# Altium schematic sheet Diode Model.SchDoc
size A4
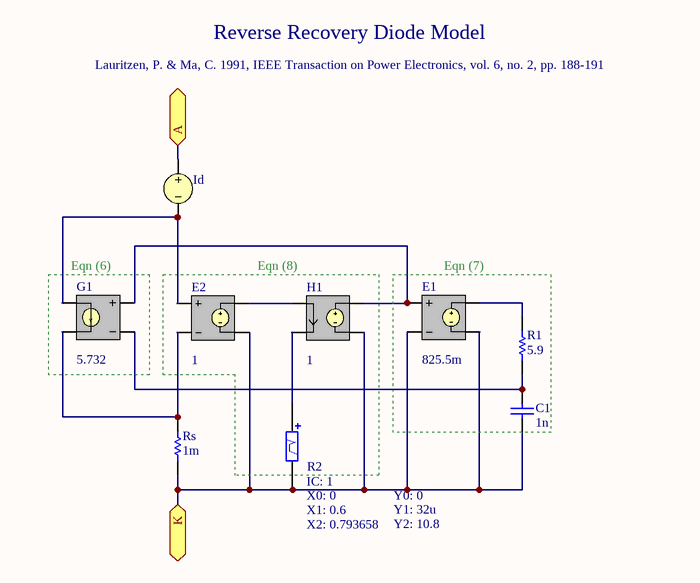
[diagram p0: Diode Model.SchDoc]

## Parts
C1  value 1n  [RAD-0.3]  (hidden comment: Cap)
E1  825.5m
E2  1
G1  5.732
H1  1
Id  VSRC  (value not drawn)
R1  value 5.9  [AXIAL-0.3]  (hidden comment: Res1)
R2  IC: 1  X0: 0  X1: 0.6  Y1: 32u  X2: 0.793658  Y2: 10.8  (hidden comment: SIMPLIS VPWLR2)
Rs  value 1m  [AXIAL-0.3]  (hidden comment: Res1)

## Blocks framed on the sheet
Eqn (6): G1
Eqn (8): E2 H1 R2
Eqn (7): C1 E1 R1

## Ports
A, K

## Nets
A: Id.1 ; port A
K: C1.1 E1.2(NC-) E1.4(N-) E2.4(N-) H1.4(N-) R2.2 Rs.1 ; port K
NetC1_2: C1.2 G1.2(NC-) R1.1
NetE1_1: E1.1(NC+) G1.1(NC+) H1.3(N+)
NetE1_3: E1.3(N+) R1.2
NetE2_1: E2.1(NC+) G1.3(N+) Id.2
NetE2_2: E2.2(NC-) G1.4(N-) Rs.2
NetE2_3: E2.3(N+) H1.1(NC+)
NetH1_2: H1.2(NC-) R2.1

## Notes on the sheet
- Reverse Recovery Diode Model
- Lauritzen, P. & Ma, C. 1991, IEEE Transaction on Power Electronics, vol. 6, no. 2, pp. 188-191

## Library data of the parts
C1 = Cap: Capacitor; Published: 8-Jun-2000; LatestRevisionDate: 17-Jul-2002; LatestRevisionNote: Re-released for DXP Platform.; PackageReference: RAD-0.3; Publisher: Altium Limited
E1 E2 = ESRC: Voltage Controlled Voltage Source; Note: PCB Footprint - Not required; Sim Note: Enter gain into gain field; Published: 8-Jun-2000; LatestRevisionDate: 17-Jul-2002; LatestRevisionNote: Re-released for DXP Platform.; PackageReference: Not Applicable; Publisher: Altium Limited
  E1: Gain: 825.5m
  E2: Gain: 1
G1 = GSRC: Voltage Controlled Current Source; Note: PCB Footprint - Not required; Sim Note: Enter gain into GAIN field; Published: 8-Jun-2000; LatestRevisionDate: 17-Jul-2002; LatestRevisionNote: Re-released for DXP Platform.; PackageReference: Not Applicable; Publisher: Altium Limited; Gain: 5.732
H1 = HSRC: Current Controlled Voltage Source; Note: PCB Footprint - Not required; Sim Note: Enter gain into gain field; Published: 8-Jun-2000; LatestRevisionDate: 17-Jul-2002; LatestRevisionNote: Re-released for DXP Platform.; PackageReference: Not Applicable; Publisher: Altium Limited; Gain: 1
Id = VSRC: Voltage Source; Note: PCB Footprint - Not required; Value: 0; Published: 8-Jun-2000; LatestRevisionDate: 17-Jul-2002; LatestRevisionNote: Re-released for DXP Platform.; PackageReference: Not Applicable; Publisher: Altium Limited
R1 Rs = Res1: Resistor; Published: 8-Jun-2000; LatestRevisionDate: 17-Jul-2002; LatestRevisionNote: Re-released for DXP Platform.; PackageReference: AXIAL-0.3; Publisher: Altium Limited
R2 = SIMPLIS VPWLR2: Voltage-Controlled Piecewise Linear Resistor (2-segment); Published: 24-Mar-1999; LatestRevisionDate: 04-Mar-2005; LatestRevisionNote: PCB Footprint replaced.; PackageReference: 6-0805; Publisher: Altium Limited; Y0: 0